# Altium schematic sheet 51-2001-01-9_04 Power Module Schematic.SchDoc
size 431 x 279 mm; Organization: ORGANIZATION; Address1: ADDRESS 1; Address2: ADDRESS 2; Address3: ADDRESS 3; Address4: ADDRESS 4; Revision: -; SheetNumber: 4; SheetTotal: 4; ENG_APP_DATE: --/--/--; DSN_APP_DATE: --/--/--; CHK_APP_DATE: --/--/--
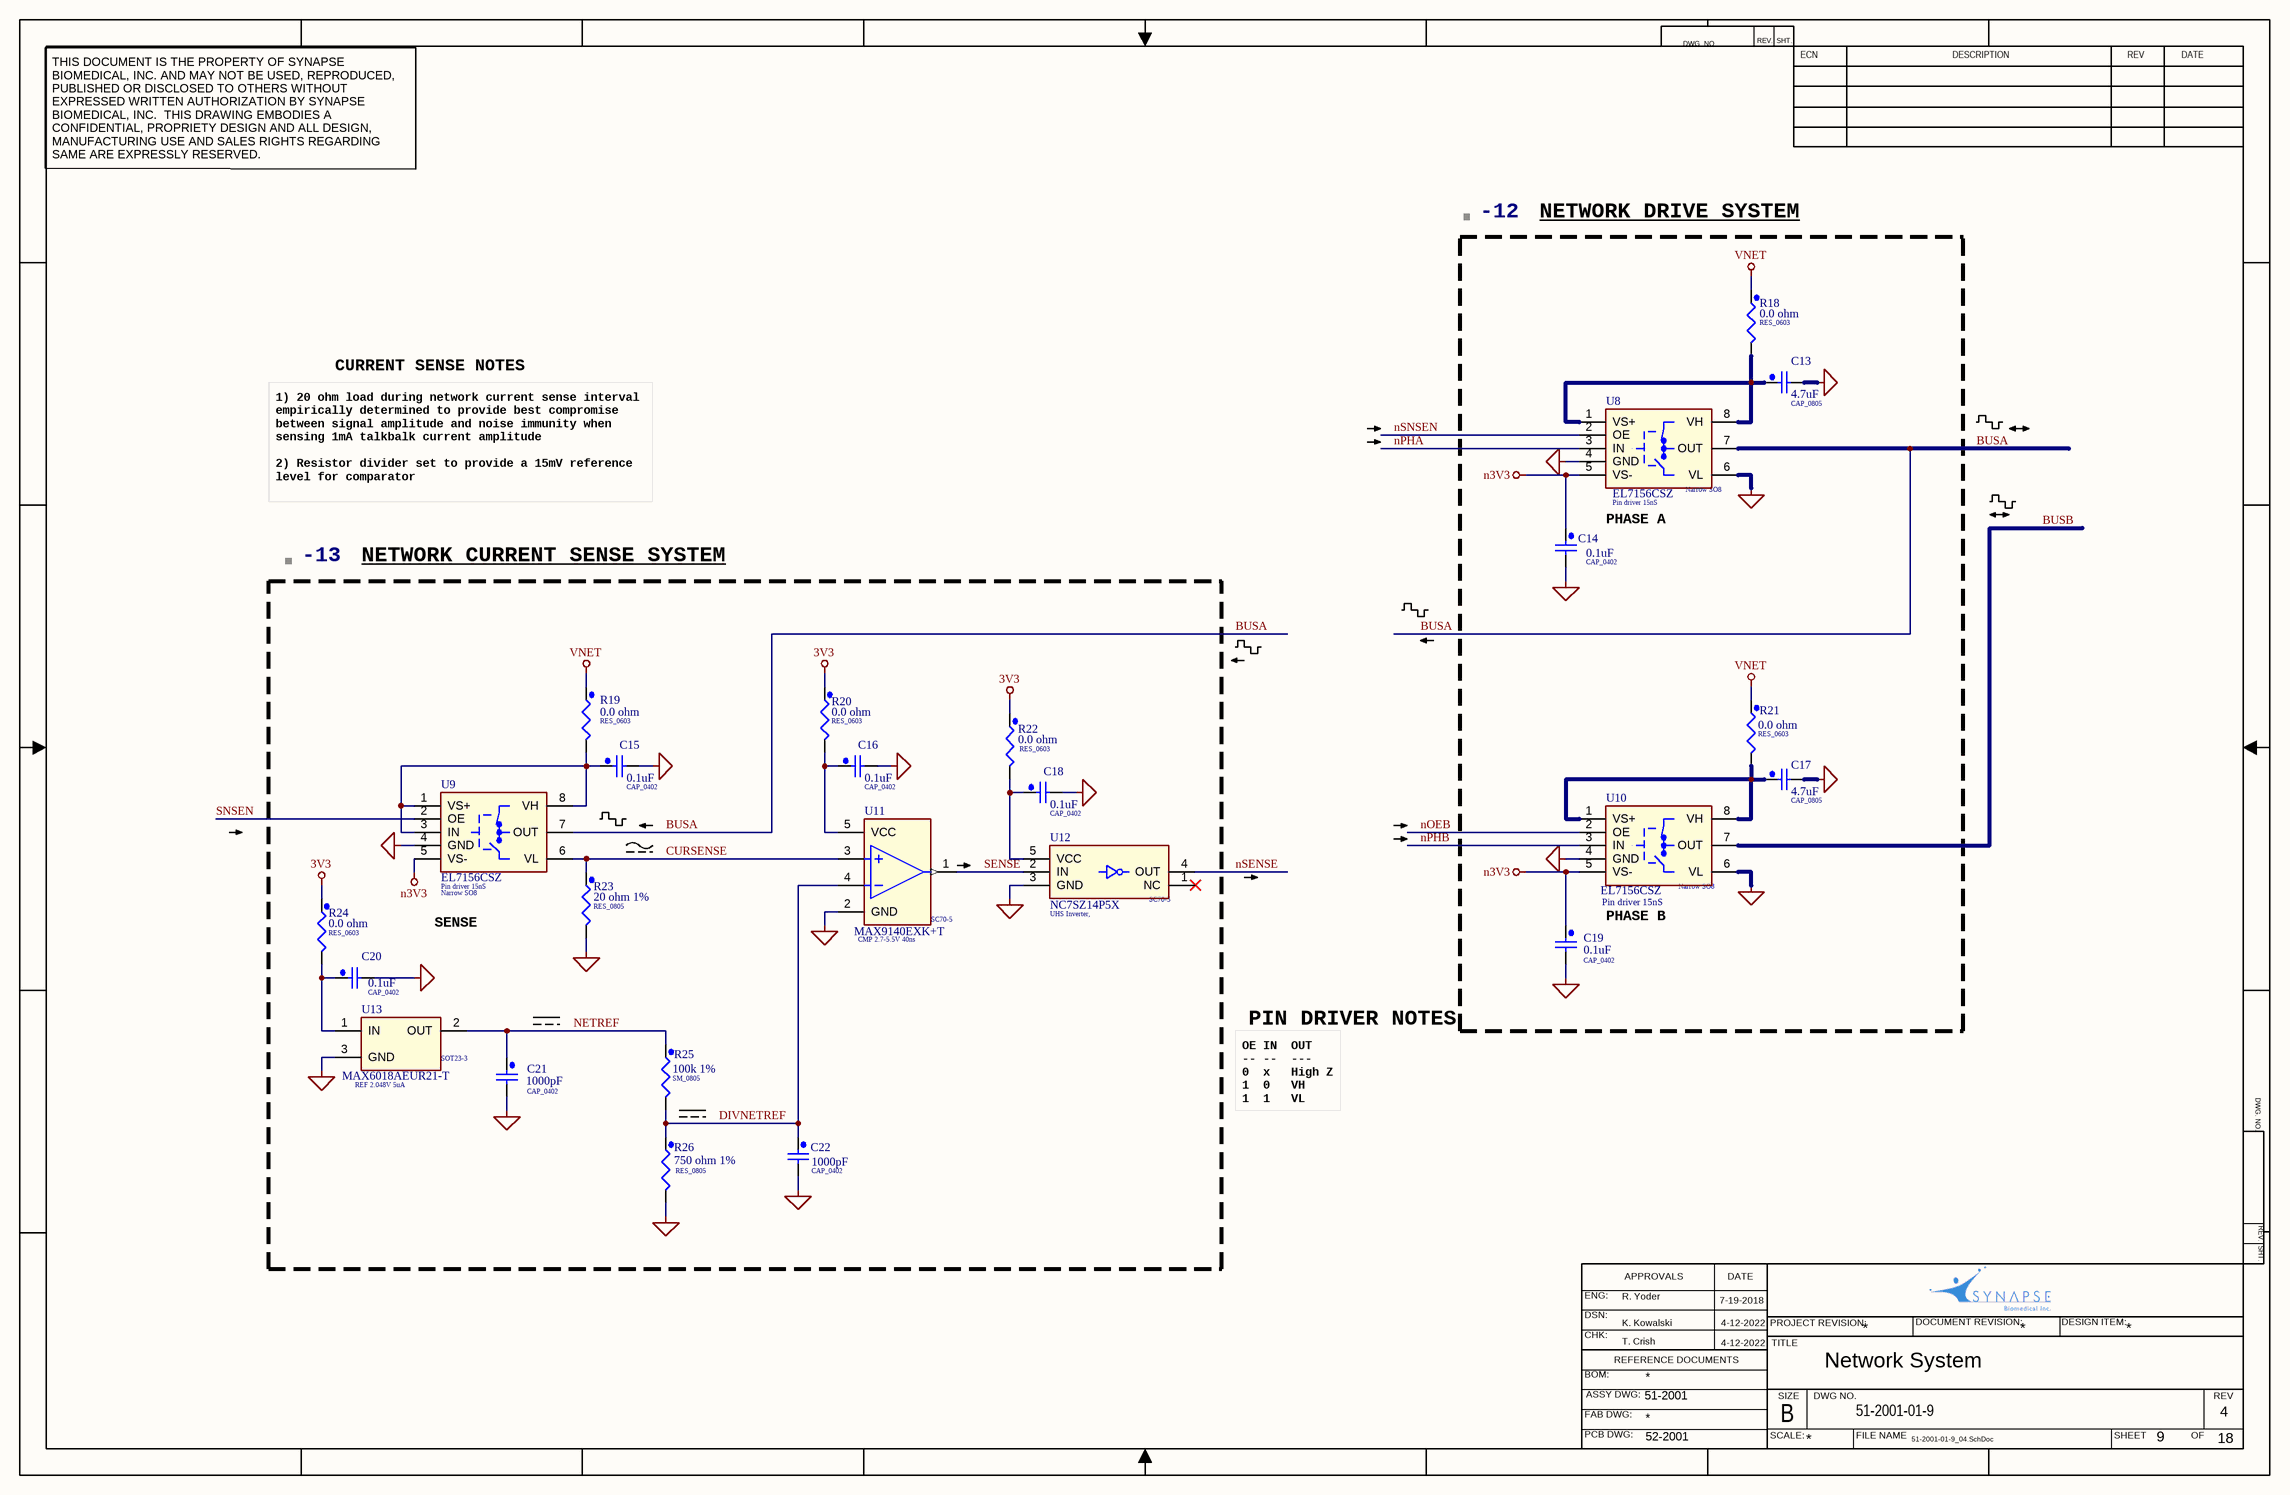
[diagram p0: 51-2001-01-9_04 Power Module Schematic.SchDoc]

## Parts
-12  XDESCRIPTION: NETWORK DRIVE SYSTEM  (hidden comment: BOM_S1)  (graphical)
-13  XDESCRIPTION: NETWORK CURRENT SENSE SYSTEM  (hidden comment: BOM_S1)  (graphical)
C13  value 4.7uF  [CAP_0805]  (hidden comment: C_4u7_X5R_25_0805_10%)
C14  value 0.1uF  [CAP_0402]  (hidden comment: C_100n_X7R_16_0402_10%)
C15  value 0.1uF  [CAP_0402]  (hidden comment: C_100n_X7R_16_0402_10%)
C16  value 0.1uF  [CAP_0402]  (hidden comment: C_100n_X7R_16_0402_10%)
C17  value 4.7uF  [CAP_0805]  (hidden comment: C_4u7_X5R_25_0805_10%)
C18  value 0.1uF  [CAP_0402]  (hidden comment: C_100n_X7R_16_0402_10%)
C19  value 0.1uF  [CAP_0402]  (hidden comment: C_100n_X7R_16_0402_10%)
C20  value 0.1uF  [CAP_0402]  (hidden comment: C_100n_X7R_16_0402_10%)
C21  value 1000pF  [CAP_0402]  (hidden comment: C_1n_C0G_50_0402_5%)
C22  value 1000pF  [CAP_0402]  (hidden comment: C_1n_C0G_50_0402_5%)
R18  value 0.0 ohm  [RES_0603]  (hidden comment: R_0_0603)
R19  value 0.0 ohm  [RES_0603]  (hidden comment: R_0_0603)
R20  value 0.0 ohm  [RES_0603]  (hidden comment: R_0_0603)
R21  value 0.0 ohm  [RES_0603]  (hidden comment: R_0_0603)
R22  value 0.0 ohm  [RES_0603]  (hidden comment: R_0_0603)
R23  value 20 ohm 1%  [RES_0805]  (hidden comment: R_20_0805)
R24  value 0.0 ohm  [RES_0603]  (hidden comment: R_0_0603)
R25  value 100k 1%  PackageDescription: SM_0805  [RES_0805]  (hidden comment: R_100k_0805_0%1)
R26  value 750 ohm 1%  [RES_0805]  (hidden comment: R_750_0805_0%1)
U8  Pin driver 15nS  PackageDescription: Narrow SO8  [SOIC8-N]
U9  Pin driver 15nS  PackageDescription: Narrow SO8  [SOIC8-N]
U10  Pin driver 15nS  PackageDescription: Narrow SO8  [SOIC8-N]
U11  CMP 2.7-5.5V 40ns  MPN: MAX9140EXK+T  [SC70-5]
U12  UHS Inverter,  [SC70-5]
U13  REF 2.048V 5uA  [SOT23-3]

## Blocks framed on the sheet
SENSE: C15 C16 C18 C20-C22 R19 R20 R22-R26 U9 U11-U13

## Nets
3V3: R20.1 R22.1 R24.1
GND: C13.2 C14.2 C15.2 C16.2 C17.2 C18.2 C19.2 C20.2 C21.2 C22.2 R23.2 R26.2 U8.4(GND) U8.6(VL) U9.4(GND) U10.4(GND) U10.6(VL) U11.2(GND) U12.3(GND) U13.3(GND)
n3V3: C14.1 C19.1 U8.5(VS-) U9.5(VS-) U10.5(VS-)
VNET: R18.1 R19.1 R21.1
BUSA: U8.7(OUT) U9.7(OUT)
BUSB: U10.7(OUT)
CURSENSE: R23.1 U9.6(VL) U11.3(IN+)
DIVNETREF: C22.1 R25.2 R26.1 U11.4(IN-)
NETREF: C21.1 R25.1 U13.2(OUT)
nOEB: U10.2(OE)
nPHA: U8.3(IN)
nPHB: U10.3(IN)
nSENSE: U12.4(OUT)
nSNSEN: U8.2(OE)
SENSE: U11.1(OUTA) U12.2(IN)
SNSEN: U9.2(OE)
NetC13_1: C13.1 R18.2 U8.1(VS+) U8.8(VH)
NetC15_1: C15.1 R19.2 U9.1(VS+) U9.3(IN) U9.8(VH)
NetC16_1: C16.1 R20.2 U11.5(VCC)
NetC17_1: C17.1 R21.2 U10.1(VS+) U10.8(VH)
NetC18_1: C18.1 R22.2 U12.5(VCC)
NetC20_1: C20.1 R24.2 U13.1(IN)

Not connected (* = marked no-connect by the designer): U12 1(NC)*

## Notes on the sheet
- DWG. NO.
- REV.
- SHT.
- ECN
- DESCRIPTION
- REV
- DATE
- THIS DOCUMENT IS THE PROPERTY OF SYNAPSE BIOMEDICAL, INC. AND MAY NOT BE USED, REPRODUCED, PUBLISHED OR DISCLOSED TO OTHERS WITHOUT EXPRESSED WRITTEN AUTHORIZATION BY SYNAPSE BIOMEDICAL, INC.  THIS DRAWING EMBODIES A CONFIDENTIAL, PROPRIETY DESIGN AND ALL DESIGN, MANUFACTURING USE AND SALES RIGHTS REGARDING SAME ARE EXPRESSLY RESERVED.
- CURRENT SENSE NOTES
- 1) 20 ohm load during network current sense interval empirically determined to provide best compromise between signal amplitude and noise immunity when sensing 1mA talkbalk current amplitude
  2) Resistor divider set to provide a 15mV reference level for comparator
- PHASE A
- PHASE B
- PIN DRIVER NOTES
- OE IN  OUT
  -- --  ---
  0  x   High Z
  1  0   VH
  1  1   VL
- ENG:
- R. Yoder
- APPROVALS
- 7-19-2018
- DSN:
- CHK:
- REFERENCE DOCUMENTS
- K. Kowalski
- T. Crish
- 4-12-2022
- PROJECT REVISION:
- TITLE
- Network System
- *
- DOCUMENT REVISION:
- DESIGN ITEM:
- BOM:
- FAB DWG:
- PCB DWG:
- ASSY DWG:
- 51-2001
- SCALE:
- SIZE
- B
- DWG NO.
- 51-2001-01-9
- FILE NAME
- SHEET
- OF
- 4
- 52-2001
- 51-2001-01-9_04.SchDoc
- 9
- 18

## Library data of the parts
-12 -13 = BOM_S1: BOM item small graphic
C13 C17 = TMK212BJ475KG-T: 4.7uF, 25V, X5R, 10%, 0805, RoHS; MFR: Murata Electronics North America; MPN: GRM21BR61E475KA12L; SBI: 53-0077; PackageDescription: CAP_0805; Supplier 1: Digi-Key; Supplier Part Number 1: 490-3261-6-ND
C14-C16 C18-C20 = GRM155R71C104KA88D: 0.1uF, 16V, X7R, 0402, RoHS; MFR: Murata; SBI: 53-0040-1; PackageDescription: CAP_0402; Supplier 1: Digi-Key; Supplier Part Number 1: 490-3261-2-ND; MPN: GRM155R71C104KA88D
C21 C22 = GRM1555C1H102JA01D: 1000pF, 50V, C0G, 5%, 0402, RoHS; MFR: Murata; SBI: 53-0041-2; ClassName: THMREF; PackageDescription: CAP_0402; Supplier 1: Digi-Key; Supplier Part Number 1: 490-3244-1-ND; MPN: GRM1555C1H102JA01D
R18-R22 R24 = MCR03ERTJ000: 0.0 ohm, 1/16W, 0603, RoHS; MFR: Vishay Dale; MPN: CRCW06030000Z0EA; SBI: 53-0075; PackageDescription: RES_0603; Supplier 1: Digi-Key; Supplier Part Number 1: 541-1.00KLDKR-ND
R23 = MCR10EZHF20R0: 20 ohm, 1%, 1/8W, 0805, RoHS; MFR: Vishay Dale; MPN: CRCW080520R0FKEA; SBI: 53-0023-03; PackageDescription: RES_0805; Supplier 1: Digi-Key; Supplier Part Number 1: 541-1.00KLDKR-ND
R25 = RG2012P-104-B-T5: 100k ohm, 0.1%, 1/8W, 0805, RoHS; MFR: Vishay Dale; MPN: TNPW0805100KBEEA; SBI: 53-0084; Supplier 1: Digi-Key; Supplier Part Number 1: TNP100KABDKR-ND
R26 = RG2012P-751-B-T5: 750 ohm, 0.1%, 1/8W, 080, RoHS; MFR: Susumu; SBI: 53-0086; PackageDescription: RES_0805; Supplier 1: Digi-Key; Supplier Part Number 1: RG20P750BCT-ND; MPN: RG2012P-751-B-T5
U8-U10 = EL7156CSZ: Pin driver, 15nS,  40 MHz, SO8, RoHS; MFR: Intersil; SBI: 54-0092; Supplier Part Number 1: EL7156CSZ-T7DKR-ND; Supplier 1: Digi-Key; MPN: EL7156CSZ
U11 = MAX9140EXK: Comparator, 2.7-5.5V, 40ns, SC70-5, RoHS; MFR: Maxim Integrated; SBI: 54-0094; PackageDescription: SC70-5; Supplier 1: Digi-Key; Supplier Part Number 1: MAX9140EXK+TCT-ND
U12 = NC7SZ14P5X: Ultra high speed Inverter, SC70-5, RoHS; MFR: Fairchild; Supplier 1: Mouser; Supplier Part Number 1: 512-NC7SZ14P5X; PackageDescription: SC70-5; MPN: NC7SZ14P5X
U13 = MAX6018AEUR21-T: Ref, 2.048V, 5uA, SOT23-3, RoHS; MFR: Maxim Integrated; SBI: 54-0087; PackageDescription: SOT23-3; ClassName: THMREF; Supplier 1: Digi-Key; Supplier Part Number 1: MAX6018AEUR21+TDKR-ND; MPN: MAX6018AEUR21-T